# Altium schematic sheet USB_Interface.SchDoc
size A4; DrawnBy: Hanif; SheetNumber: 8; SheetTotal: 8
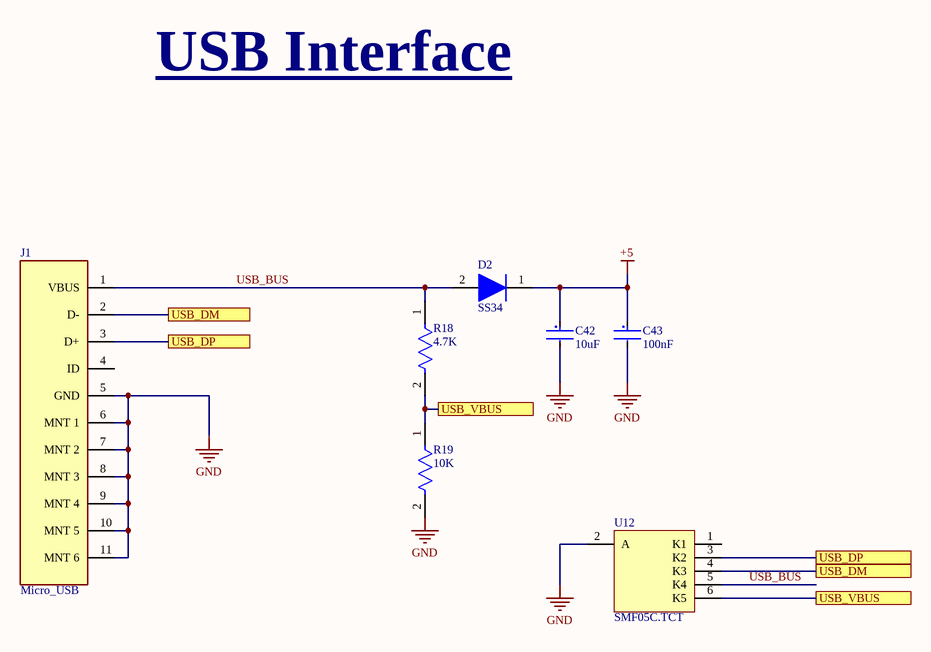
[diagram p0: USB_Interface.SchDoc]

## Parts
C42  10uF  [Samsung_CL31_IPC_A_1206]
C43  100nF  [Samsung_CL31_IPC_A_1206]
D2  SS34  [SMA (DO-214AC)]
J1  Micro_USB  [Micro_USB_47346- 1001]
R18  4.7K  [YAGEO_RC1206-0_65_IPC_A]
R19  10K  [YAGEO_RC1206-0_65_IPC_A]
U12  SMF05C.TCT  [ONSC-SC70-6-419B-02_W_V]  (no BOM)

## Ports
USB_DM, USB_DP, USB_VBUS

## Nets
+5: C42.1 C43.1 D2.1(K)
GND: C42.2 C43.2 J1.5(GND) J1.6(MNT_1) J1.7(MNT_2) J1.8(MNT_3) J1.9(MNT_4) J1.10(MNT_5) J1.11(MNT_6) R19.2 U12.2(A)
USB_BUS: D2.2(A) J1.1(VBUS) R18.1 U12.5(K4)
USB_DM: J1.2(D-) U12.4(K3) ; port USB_DM
USB_DP: J1.3(D+) U12.3(K2) ; port USB_DP
USB_VBUS: R18.2 R19.1 U12.6(K5) ; port USB_VBUS

Not connected (* = marked no-connect by the designer): J1 4(ID); U12 1(K1)

## Notes on the sheet
- USB Interface
- Project Name:
- Size:
- Date:
- A4
- Doc Num:
- Time:
- Version:
- Sheet
- of
- File:
- Drawn by:

## Library data of the parts
C42 = CL31A106KQHNNWE: CAP CER 10UF 6.3V X5R 1206, ±10% 6.3V Ceramic Capacitor X5R 1206 (3216 Metric); Supplier 1: Digi-Key; Supplier Part Number 1: 1276-3043-1-ND
C43 = CL31B104KBCNFNC: CAP CER 0.1UF 50V X7R 1206, ±10% 50V Ceramic Capacitor X7R 1206 (3216 Metric); Supplier 1: Digi-Key; Supplier Part Number 1: 1276-2744-1-ND
D2 = 1N5819RLG: Rectifier, 2-Pin Axial_Lead, Pb-Free, Tape and Reel; Manufacturer: On Semiconductor; IFSM Max (A): 25; Configuration: Single; ComponentLink1Description: Manufacturer URL; ComponentLink2Description: Datasheet; ComponentLink3Description: Package Specification; Mounting Technology: Through Hole; ComponentLink3URL: http://www.onsemi.cn/pub_link/Collateral/59-10.PDF; DatasheetVersion: Rev. 10; ComponentLink1URL: http://www.onsemi.com/; Packing: Tape and Reel; PackageVersion: Rev. U, 02/2005; PartNumber: 1N5819RLG; PackageDescription: 2-Pin, Axial Lead, Diameter 2.35 mm; ComponentLink2URL: http://www.onsemi.cn/pub_link/Collateral/1N5817-D.PDF; RoHS: TRUE; PackageReference: AXIAL_LEAD-2-59-10; Supplier 1: Newark; Supplier Part Number 1: 18C9038
J1 = Micro_USB_47346-1001: CONN RCPT USB2.0 MICRO B SMD R/A; Supplier 1: Digi-Key; Supplier Part Number 1: WM11228CT-ND
R18 = RC1206JR-071KL: 1 ±5% 0.25W, 1/4W Chip Resistor 1206 (3216 Metric) Moisture Resistant Thick Film; Supplier 1: Digi-Key; Supplier Part Number 1: 311-1.0KERCT-ND
R19 = RC1206FR-072K2L: YAGEO - RC1206FR-072K2L - Surface Mount Chip Resistor, Thick Film, RC Series, 2.2 kohm, 250 mW, 1%, 200 V RoHS Compliant: Yes; Resistance: 2.2kR; Power Rating: 250mW; Temperature Coefficient: 100ppm/°C; Voltage Rating: 200V; Supplier 1: Digi-Key; Manufacturer: Yageo; Manufacturer Part Number: RC1206FR-072K2L; RoHS: Yes; Category: Chip SMD Resistors; Stock 1: 160197; Pricing 1: 1=0.10000, 10=0.07400, 100=0.03010, 1000=0.01353, 2500=0.01174 (USD); Case/Package: 1206; Case Code (Metric): 3216; Case Code (Imperial): 1206; Weight: 0.000571oz; Size Code: 1206; Min Operating Temperature: -55°C; Max Operating Temperature: 155°C; Tolerance: 1%; Packaging: Tape and Reel; Package Quantity: 1; Resistor Type: Thick Film; Number of Terminations: 2; Termination: SMD/SMT; Max Power Dissipation: 250mW; Features: Moisture Resistant; Series: RC; Resistance Tolerance: 1%; Construction: Rectangular; Length: 3.2mm; Width: 1.6mm; Height: 0.55mm; Depth: 1.6mm; REACH SVHC: Unknown; Lead Free: Lead Free; Military Standard: Not; RoHS Compliant: Yes; ComponentLink1URL: https://datasheet.ciiva.com/2461/pyu-rc1206-51-rohs-l-4-2461488.pdf?src-supplier=Digi-Key; ComponentLink1Description: https://datasheet.ciiva.com/2461/pyu-rc1206-51-rohs-l-4-2461488.pdf?src-supplier=Digi-Key; ComponentLink2URL: https://datasheet.ciiva.com/2461/pyu-rc1206-51-rohs-l-4-2461489.pdf?src-supplier=Digi-Key; ComponentLink2Description: https://datasheet.ciiva.com/2461/pyu-rc1206-51-rohs-l-4-2461489.pdf?src-supplier=Digi-Key; ComponentLink3URL: https://datasheet.ciiva.com/2461/pyu-rc1206-51-rohs-l-4-2461490.pdf?src-supplier=Digi-Key; ComponentLink3Description: https://datasheet.ciiva.com/2461/pyu-rc1206-51-rohs-l-4-2461490.pdf?src-supplier=Digi-Key; ComponentLink4URL: https://datasheet.ciiva.com/16978/pyu-rc1206-51-rohs-l-4-16978023.pdf?src-supplier=Future+Electronics; ComponentLink4Description: https://datasheet.ciiva.com/16978/pyu-rc1206-51-rohs-l-4-16978023.pdf?src-supplier=Future+Electronics; Supplier Part Number 1: 311-2.20KFRCT-ND
U12 = SMF05C.TCT: ESD Suppressor TVS 15KV 6-Pin SC-70 T/R; Manufacturer: Semtech; Direction: Unidirectional; Capacitance: 130pF; Reverse Breakdown Voltage: 6V; Number of Elements: 5; Element Configuration: Common Anode; Reverse Standoff Voltage: 5V; Clamping Voltage: 12.5V; Peak Pulse Power: 100W; Power Line Protection: No; Leakage Current: 5uA; Peak Pulse Current: 8A; Test Current: 1mA; ESD Protection: Yes; Diode Type: ZENER; Supplier 1: Digi-Key; Manufacturer Part Number: SMF05C.TCT; RoHS: Yes; Category: TVS Diodes; Stock 1: 5534; Pricing 1: 1=0.87000, 10=0.76200, 100=0.58440, 500=0.46200, 1000=0.36960 (USD); Mount: Surface Mount; Case/Package: SC; Number of Pins: 6; Min Operating Temperature: -55°C; Max Operating Temperature: 125°C; Packaging: Tape and Reel; Number of Channels: 5; Number of Unidirectional Channels: 5; Min Breakdown Voltage: 6V; Working Voltage: 5V; Polarity: Unidirectional; Max Reverse Leakage Current: 5uA; Max Breakdown Voltage: 6V; Voltage Rating (DC): 5V; Operating Supply Voltage: 5V; Resistor Type: Zener; Series: SMF; Clamping Voltage-Max: 12.5V; Length: 2mm; Width: 1.25mm; Height: 0.9mm; Depth: 1.25mm; Radiation Hardening: No; Lead Free: Lead Free; RoHS Compliant: Yes; ComponentLink1URL: https://datasheet.ciiva.com/338/smf05c-338385.pdf?src-supplier=Digi-Key; ComponentLink1Description: https://datasheet.ciiva.com/338/smf05c-338385.pdf?src-supplier=Digi-Key; ComponentLink2URL: https://datasheet.ciiva.com/18065/getdatasheetpartid-89007-18065142.pdf?src-supplier=Verical; ComponentLink2Description: https://datasheet.ciiva.com/18065/getdatasheetpartid-89007-18065142.pdf?src-supplier=Verical; ComponentLink3URL: https://datasheet.ciiva.com/338/smf05c-338386.pdf?src-supplier=Digi-Key; ComponentLink3Description: https://datasheet.ciiva.com/338/smf05c-338386.pdf?src-supplier=Digi-Key; ComponentLink4URL: https://datasheet.ciiva.com/338/smf05c-338387.pdf?src-supplier=Digi-Key; ComponentLink4Description: https://datasheet.ciiva.com/338/smf05c-338387.pdf?src-supplier=Digi-Key; ComponentLink5URL: https://datasheet.ciiva.com/16387/smf05c-16387308.pdf?src-supplier=Future+Electronics; ComponentLink5Description: https://datasheet.ciiva.com/16387/smf05c-16387308.pdf?src-supplier=Future+Electronics; Supplier Part Number 1: SMF05CCT-ND